# Altium schematic sheet PUS_Decoupling.SchDoc: PSU_DECOUPLING
size A4; DocumentNumber: 18; SheetNumber: 18; SheetTotal: 18
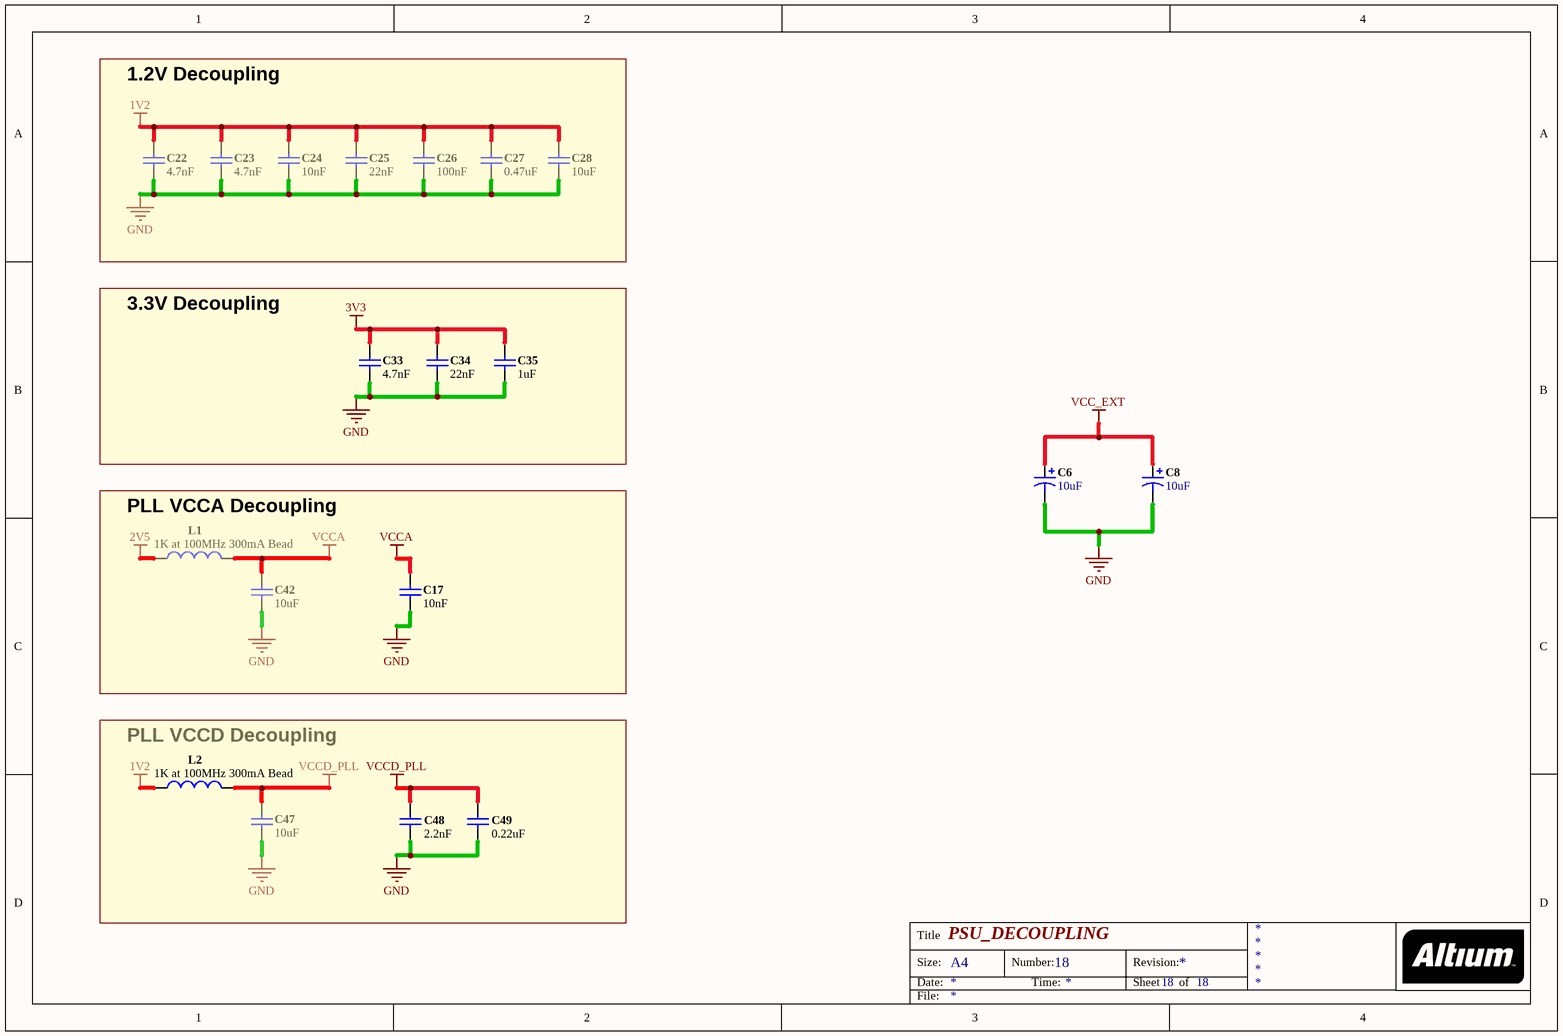
[diagram p0: PUS_Decoupling.SchDoc]

## Parts
C6  10uF  [AVX-CAPC3528_V]
C8  10uF  [AVX-CAPC3528_V]
C17  10nF  [0603C-GENERIC]
C22  4.7nF  [0603C-GENERIC]
C23  4.7nF  [0603C-GENERIC]
C24  10nF  [0603C-GENERIC]
C25  22nF  [0603C-GENERIC]
C26  100nF  [0603C-GENERIC]
C27  0.47uF  [0603C-GENERIC]
C28  10uF  [0603C-GENERIC]
C33  4.7nF  [0603C-GENERIC]
C34  22nF  [0603C-GENERIC]
C35  1uF  [0603C-GENERIC]
C42  10uF  [0805C-GENERIC]
C47  10uF  [0805C-GENERIC]
C48  2.2nF  [0603C-GENERIC]
C49  0.22uF  [0603C-GENERIC]
L1  1K at 100MHz 300mA Bead  [0805FB-1KZ]
L2  1K at 100MHz 300mA Bead  [0805FB-1KZ]

## Blocks framed on the sheet
1.2V Decoupling: C22-C28
3.3V Decoupling: C33-C35
PLL VCCA Decoupling: C17 C42 L1
PLL VCCD Decoupling: C47-C49 L2

## Nets
1V2: C22.1 C23.1 C24.1 C25.1 C26.1 C27.1 C28.1 L2.1
2V5: L1.1
3V3: C33.1 C34.1 C35.1
GND: C6.2 C8.2 C17.1 C22.2 C23.2 C24.2 C25.2 C26.2 C27.2 C28.2 C33.2 C34.2 C35.2 C42.1 C47.1 C48.2 C49.2
VCC_EXT: C6.1 C8.1
VCCA: C17.2 C42.2 L1.2
VCCD_PLL: C47.2 C48.1 C49.1 L2.2

## Notes on the sheet
- Title
- Size:
- Date:
- A4
- Number:
- Time:
- Revision:
- Sheet
- of
- File:

## Library data of the parts
C6 C8 = CMP-0279-00001-1: Capacitor, Tantalum, 10uF 10% 20V MCCT-B (3528); PartNumber: TAJB106K020RNJ; Manufacturer: AVX; Polarity: Polarized; PackageDescription: 2-Pin SMT Capacitor, 3.5 x 2.8 mm Body; ComponentLink1URL: http://www.avx.com/; PackageReference: CAPC3528; ComponentLink2Description: Datasheet; Value: 10uF; Technology: Tantalum; ComponentLink2URL: http://www.avx.com/docs/Catalogs/taj.pdf; Tolerance: 10%; ComponentLink1Description: Manufacturer URL; Rated Voltage: 20V; DatasheetVersion: Jun-13; Mounting Technology: Surface Mount
C17 C22 C23 C33 = CAP 470nF 10V ±10% 0402 (1005 Metric) Thickness 0.6mm SMD: Capacitor, Ceramic, 10% 10V 0603 X7R; Case-Metric: 1005; Case-EIA: 0402; Rated Voltage: 10 V; Max Thickness: 0.6 mm; Technology: SMT; Tolerance: ±10%
  C17: Value: 10nF
  C22 C23 C33: Value: 4.7nF
C24-C27 C34 C35 C48 C49 = CAP 4.7uF 10V ±10% 0603 (1608 Metric) Thickness 0.55mm SMD: Capacitor, Ceramic, 10% 10V 0603 X7R; Case-Metric: 1608; Case-EIA: 0603; Rated Voltage: 10 V; Technology: SMT; Max Thickness: 0.55 mm; Tolerance: ±10%
  C24: Value: 10nF
  C25 C34: Value: 22nF
  C26: Value: 100nF
  C27: Value: 0.47uF
  C35: Value: 1uF
  C48: Value: 2.2nF
  C49: Value: 0.22uF
C28 = CAP 4.7uF 10V ±10% 0603 (1608 Metric) Thickness 0.55mm SMD: Capacitor, Ceramic, 10% 10V 0603 X7R; Case-Metric: 1608; Case-EIA: 0805; Rated Voltage: 10 V; Technology: SMT; Max Thickness: 0.55 mm; Tolerance: ±10%; Value: 10uF
C42 C47 = CAP 470nF 10V ±10% 0402 (1005 Metric) Thickness 0.6mm SMD: Capacitor, Ceramic, 10% 10V 0805 X7R; Case-Metric: 1005; Case-EIA: 0402; Rated Voltage: 10 V; Value: 10uF; Max Thickness: 0.6 mm; Technology: SMT; Tolerance: ±10%
L1 L2 = D-102-0026: Inductor, Ferrite Bead 1K@100MHz 300mA 0805 BK1005HS102-T; Inductance: nH; Max Input Current: 300 mA; Mounting Technology: Surface Mount; Status: Production; Category: Inductor